# EAGLE design binarywatch (EAGLE 6.6.0)
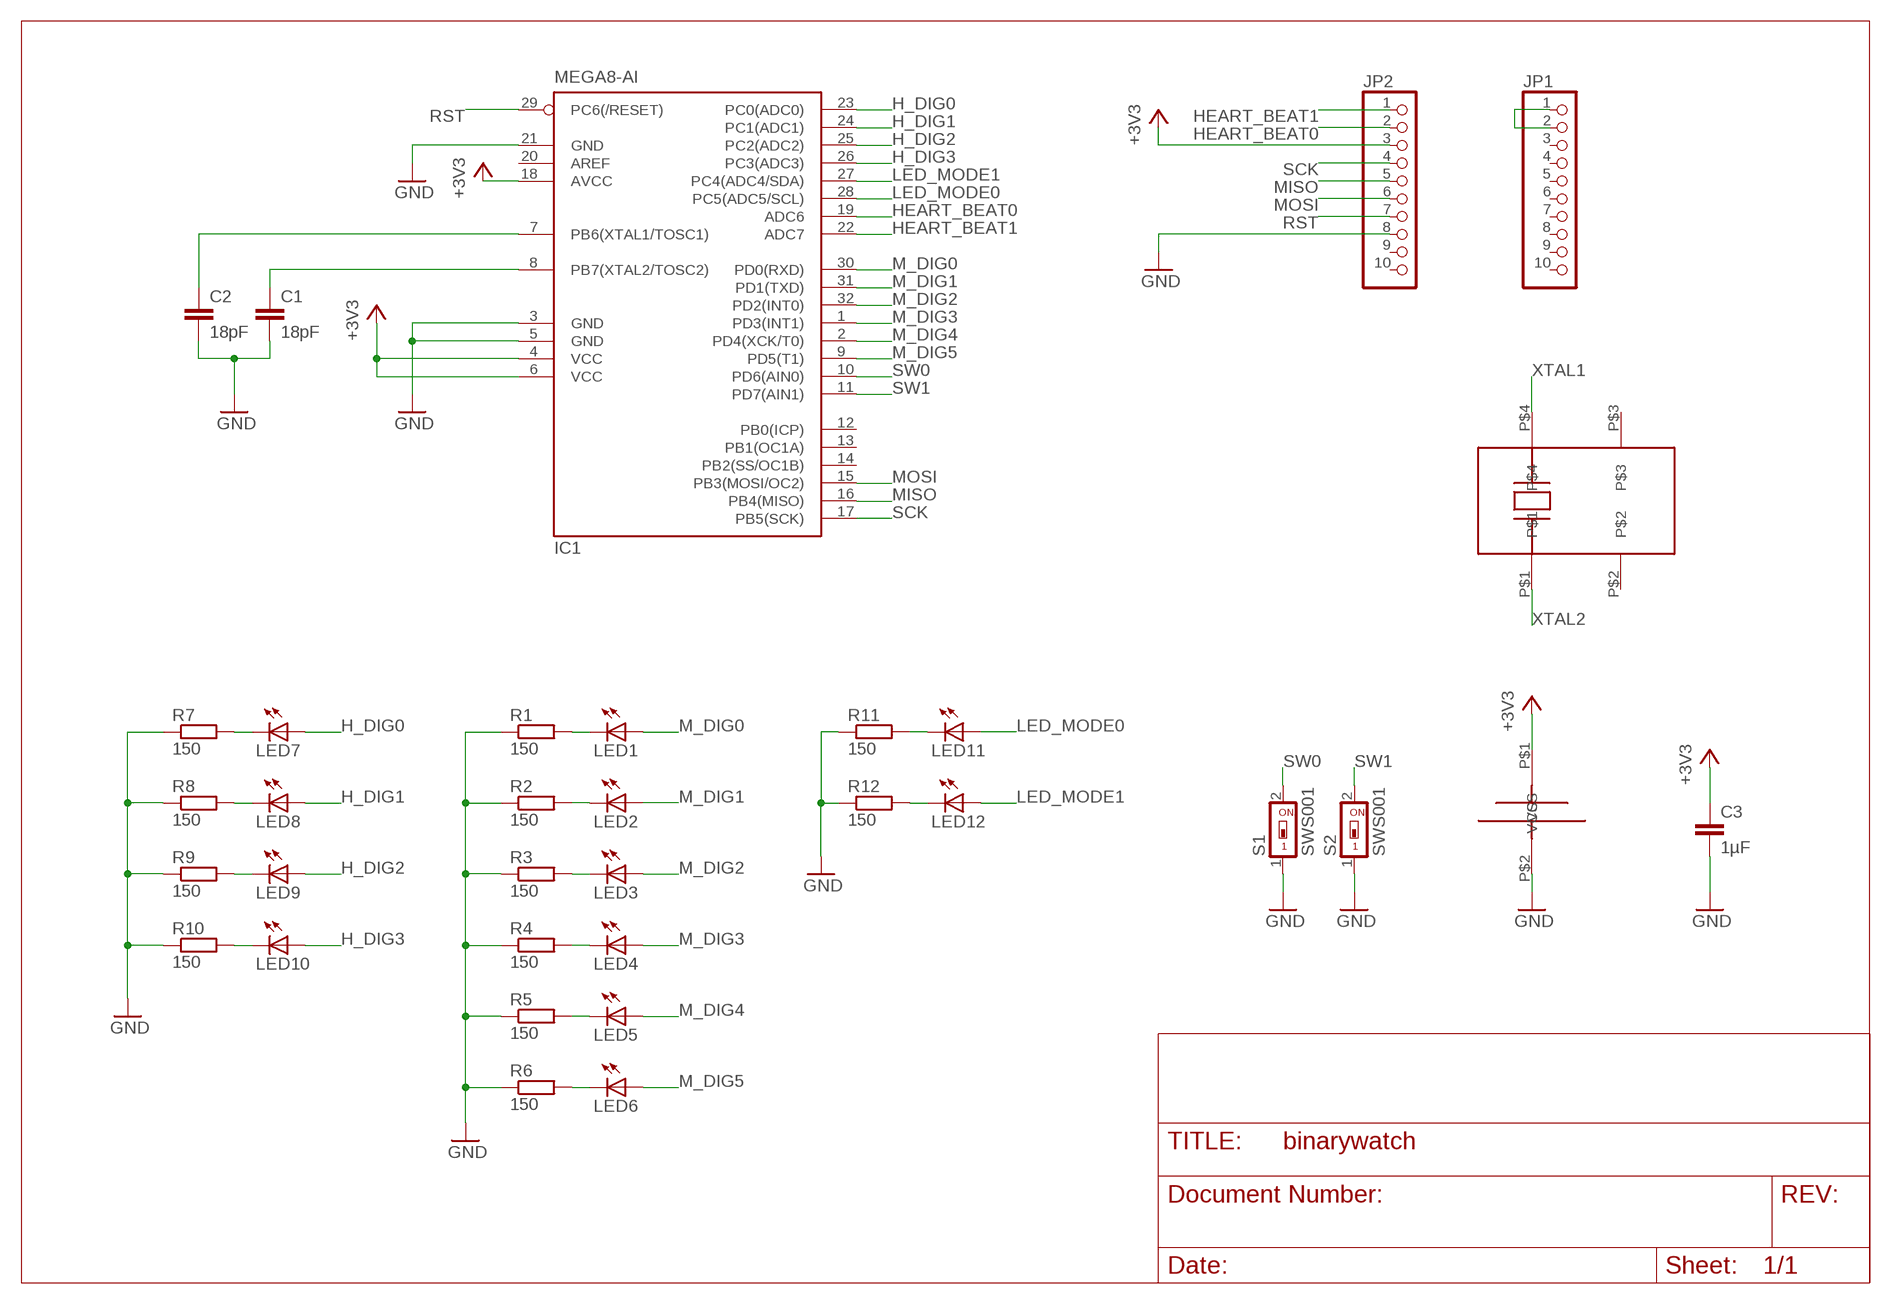
[diagram p0: schematic, sheet 1]

## Parts
C1  18pF  C-EUC0805  [C0805]
C2  18pF  C-EUC0805  [C0805]
C3  1µF  C-EUC0805  [C0805]
IC1  MEGA8-AI  [TQFP32-08]
JP1  PINHD-1X10  [1X10]
JP2  PINHD-1X10  [1X10]
K1  LZH20-1  [LZH20-1]
LED1  LEDCHIPLED_0805  [CHIPLED_0805]
LED2  LEDCHIPLED_0805  [CHIPLED_0805]
LED3  LEDCHIPLED_0805  [CHIPLED_0805]
LED4  LEDCHIPLED_0805  [CHIPLED_0805]
LED5  LEDCHIPLED_0805  [CHIPLED_0805]
LED6  LEDCHIPLED_0805  [CHIPLED_0805]
LED7  LEDCHIPLED_0805  [CHIPLED_0805]
LED8  LEDCHIPLED_0805  [CHIPLED_0805]
LED9  LEDCHIPLED_0805  [CHIPLED_0805]
LED10  LEDCHIPLED_0805  [CHIPLED_0805]
LED11  LEDCHIPLED_0805  [CHIPLED_0805]
LED12  LEDCHIPLED_0805  [CHIPLED_0805]
R1  150  R-EU_R0805  [R0805]
R2  150  R-EU_R0805  [R0805]
R3  150  R-EU_R0805  [R0805]
R4  150  R-EU_R0805  [R0805]
R5  150  R-EU_R0805  [R0805]
R6  150  R-EU_R0805  [R0805]
R7  150  R-EU_R0805  [R0805]
R8  150  R-EU_R0805  [R0805]
R9  150  R-EU_R0805  [R0805]
R10  150  R-EU_R0805  [R0805]
R11  150  R-EU_R0805  [R0805]
R12  150  R-EU_R0805  [R0805]
S1  SWS001  [SMS-001]
S2  SWS001  [SMS-001]
U$1  32768KHZ  [32768KHZ]

## Nets
+3V3: C3.1 IC1.4(VCC) IC1.6(VCC) IC1.18(AVCC) JP2.3 K1.P$1(VCC)
GND: C1.2 C2.2 C3.2 IC1.3(GND) IC1.5(GND) IC1.21(GND) JP2.8 K1.P$2(VSS) R1.1 R2.1 R3.1 R4.1 R5.1 R6.1 R7.1 R8.1 R9.1 R10.1 R11.1 R12.1 S1.1 S2.1
H_DIG0: IC1.23(PC0(ADC0)) LED7.A
H_DIG1: IC1.24(PC1(ADC1)) LED8.A
H_DIG2: IC1.25(PC2(ADC2)) LED9.A
H_DIG3: IC1.26(PC3(ADC3)) LED10.A
HEART_BEAT0: IC1.19(ADC6) JP2.2
HEART_BEAT1: IC1.22(ADC7) JP2.1
LED_MODE0: IC1.28(PC5(ADC5/SCL)) LED11.A
LED_MODE1: IC1.27(PC4(ADC4/SDA)) LED12.A
M_DIG0: IC1.30(PD0(RXD)) LED1.A
M_DIG1: IC1.31(PD1(TXD)) LED2.A
M_DIG2: IC1.32(PD2(INT0)) LED3.A
M_DIG3: IC1.1(PD3(INT1)) LED4.A
M_DIG4: IC1.2(PD4(XCK/T0)) LED5.A
M_DIG5: IC1.9(PD5(T1)) LED6.A
MISO: IC1.16(PB4(MISO)) JP2.5
MOSI: IC1.15(PB3(MOSI/OC2)) JP2.6
N$1: LED7.C R7.2
N$2: LED8.C R8.2
N$3: LED9.C R9.2
N$4: LED10.C R10.2
N$5: LED1.C R1.2
N$6: LED2.C R2.2
N$7: LED3.C R3.2
N$8: LED4.C R4.2
N$11: LED11.C R11.2
N$12: LED12.C R12.2
N$15: LED6.C R6.2
N$16: LED5.C R5.2
N$17: JP1.1 JP1.2
RST: IC1.29(PC6(/RESET)) JP2.7
SCK: IC1.17(PB5(SCK)) JP2.4
SW0: IC1.10(PD6(AIN0)) S1.2
SW1: IC1.11(PD7(AIN1)) S2.2
XTAL1: C2.1 IC1.7(PB6(XTAL1/TOSC1)) U$1.P$4
XTAL2: C1.1 IC1.8(PB7(XTAL2/TOSC2)) U$1.P$1
Unconnected: IC1.12(PB0(ICP)) IC1.13(PB1(OC1A)) IC1.14(PB2(SS/OC1B)) IC1.20(AREF) JP1.3 JP1.4 JP1.5 JP1.6 JP1.7 JP1.8 JP1.9 JP1.10 JP2.9 JP2.10 U$1.P$2 U$1.P$3

## Library data of the parts
C1-C3 = rcl:C-EU: CAPACITOR, European symbol
IC1 = atmel:MEGA8: MICROCONTROLLER 8 Kbytes FLASH, 1 kbytes SRAM, 512 bytes EEPROM, USART, 6-channel 10 bit ADC, 2-channel 8 bit ADC Pin compatible with Atmega48, ATMega88, ATMega168 Source: avr.lbr; MPN: ATMEGA8-16AU; OC_FARNELL: 9171371; OC_NEWARK: 73M8863
JP1 JP2 = pinhead:PINHD-1X10: PIN HEADER
K1 = kzh20-1:LZH20-1
LED1-LED12 = led:LED: LED OSRAM: - CHIPLED LG R971, LG N971, LY N971, LG Q971, LY Q971, LO R971, LY R971 LH N974, LH R974 LS Q976, LO Q976, LY Q976 LO Q996 - Hyper CHIPLED LW Q18S LB Q993, LB Q99A, LB R99A - SideLED LS A670, LO A670, LY A670, LG A670, LP A670 LB A673, LV A673, LT A673, LW A673 LH A674 LY A675 LS A676, LA A676, LO A676, LY A676, LW A676 LS A679, LY A679, LG A679 - Hyper Micro SIDELED® LS Y876, LA Y876, LO Y876, LY Y876 LT Y87S - SmartLED LW L88C, LW L88S LB L89C, LB L89S, LG L890 LS L89K, LO L89K, LY L89K LS L896, LA L896, LO L896, LY L896 - TOPLED LS T670, LO T670, LY T670, LG T670, LP T670 LSG T670, LSP T670, LSY T670, LOP T670, LYG T670 LG T671, LOG T671, LSG T671 LB T673, LV T673, LT T673, LW T673 LH T674 LS T676, LA T676, LO T676, LY T676, LB T676, LH T676, LSB T676, LW T676 LB T67C, LV T67C, LT T67C, LS T67K, LO T67K, LY T67K, LW E67C LS E67B, LA E67B, LO E67B, LY E67B, LB E67C, LV E67C, LT E67C LW T67C LS T679, LY T679, LG T679 LS T770, LO T770, LY T770, LG T770, LP T770 LB T773, LV T773, LT T773, LW T773 LH T774 LS E675, LA E675, LY E675, LS T675 LS T776, LA T776, LO T776, LY T776, LB T776 LHGB T686 LT T68C, LB T68C - Hyper Mini TOPLED® LB M676 - Mini TOPLED Santana® LG M470 LS M47K, LO M47K, LY M47K Source: http://www.osram.convergy.de LUXEON: - LUMILED® LXK2-PW12-R00, LXK2-PW12-S00, LXK2-PW14-U00, LXK2-PW14-V00 LXK2-PM12-R00, LXK2-PM12-S00, LXK2-PM14-U00 LXK2-PE12-Q00, LXK2-PE12-R00, LXK2-PE12-S00, LXK2-PE14-T00, LXK2-PE14-U00 LXK2-PB12-K00, LXK2-PB12-L00, LXK2-PB12-M00, LXK2-PB14-N00, LXK2-PB14-P00, LXK2-PB14-Q00 LXK2-PR12-L00, LXK2-PR12-M00, LXK2-PR14-Q00, LXK2-PR14-R00 LXK2-PD12-Q00, LXK2-PD12-R00, LXK2-PD12-S00 LXK2-PH12-R00, LXK2-PH12-S00 LXK2-PL12-P00, LXK2-PL12-Q00, LXK2-PL12-R00 Source: www.luxeon.com KINGBRIGHT: KA-3528ASYC Source: www.kingbright.com
R1-R12 = rcl:R-EU_: RESISTOR, European symbol
S1 S2 = smd-special:SWS001: SMD Dip Switch 1 pol.
U$1 = kzh20-1:32768KHZ

## Board
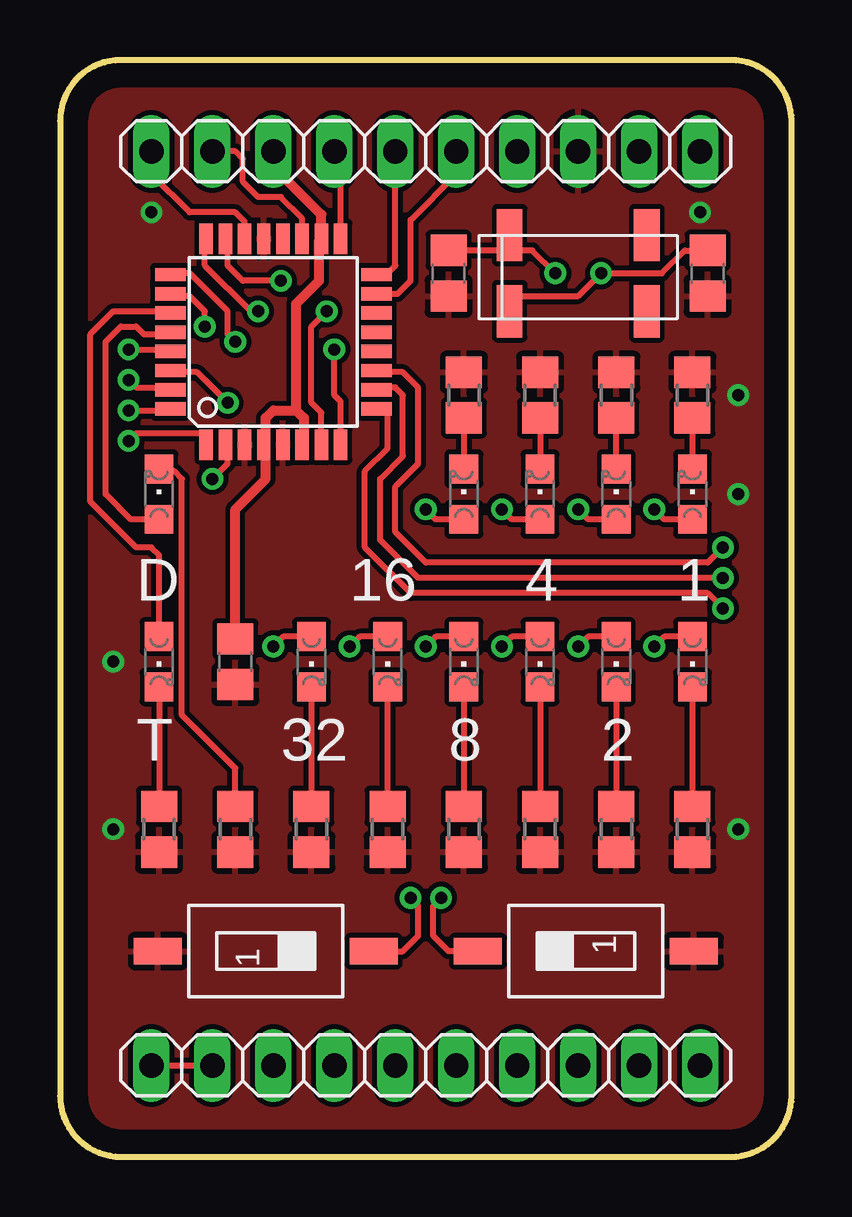
[diagram p1: board, top side]
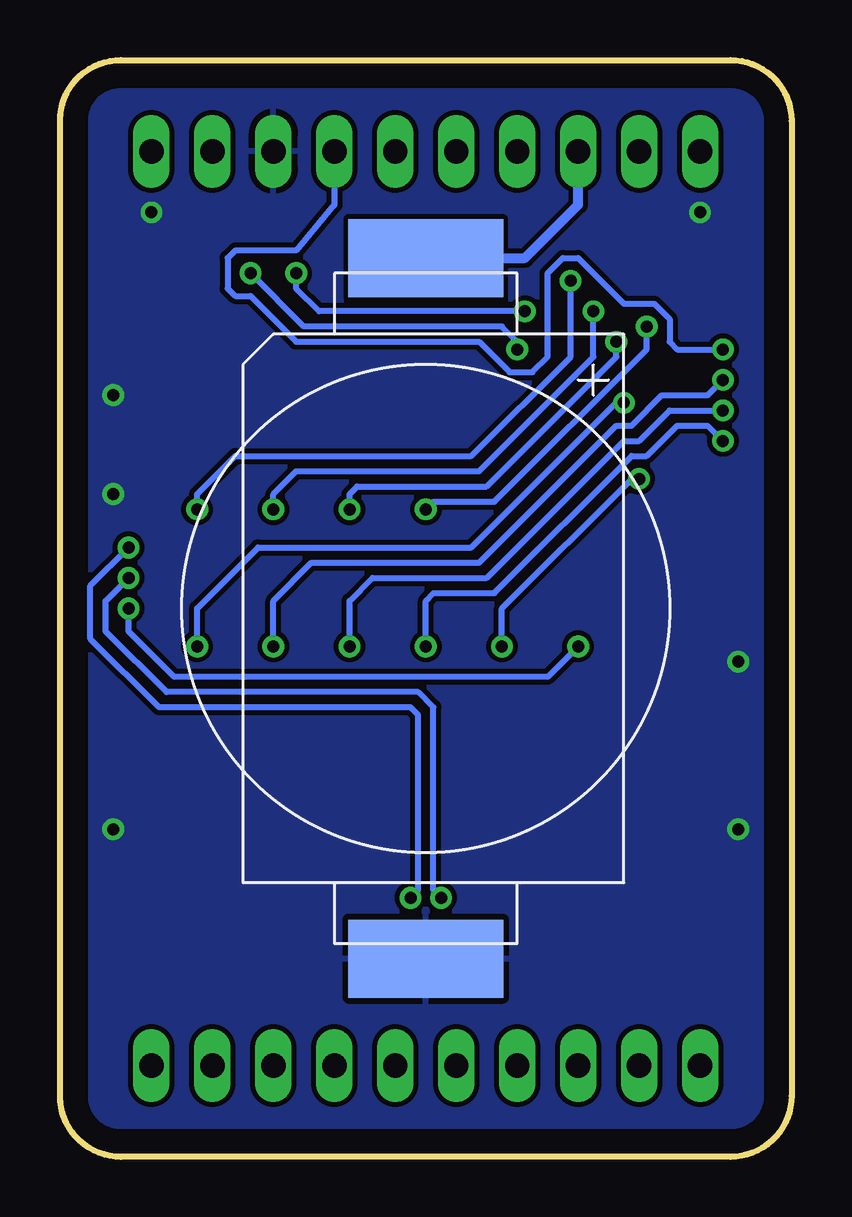
[diagram p2: board, bottom side, seen from below]

Size 30.48 x 45.72 mm. Coordinates in mm from the lower left corner, seen from the top.
Outline: 30.48,2.54 30.48,43.18 arc90 27.94,45.72 2.54,45.72 arc90 0,43.18 0,2.54 arc90 2.54,0 27.94,0 arc90 30.48,2.54
Copper layers (1*16): Top 0.035mm / dielectric 1.5mm / Bottom 0.035mm
Design rules "default *": minimum track width 10mil, minimum drill 16mil, track to track 8mil, track to pad 8mil, pad to pad 8mil, via to via 8mil, smd to smd 8mil, copper to edge 40mil, drill to drill 8mil, minimum pad ring 10mil, minimum via ring 8mil, stop-mask expansion 4mil, vias tented up to drill 0mil, thermal gap 10mil

### Footprints (pad centres in the part's own frame; a part is rotated, then mirrored left to right if it is on the bottom)
C0805 = smd 1.3 x 1.5: 1 -0.95,0; 2 0.95,0
TQFP32-08 = smd 1.27 x 0.559: 1 -4.293,2.8; 2 -4.293,2; 3 -4.293,1.2; 4 -4.293,0.4; 5 -4.293,-0.4; 6 -4.293,-1.2; 7 -4.293,-2; 8 -4.293,-2.8; 17 4.293,-2.8; 18 4.293,-2; 19 4.293,-1.2; 20 4.293,-0.4; 21 4.293,0.4; 22 4.293,1.2; 23 4.293,2; 24 4.293,2.8 | smd 0.559 x 1.27: 9 -2.8,-4.293; 10 -2,-4.293; 11 -1.2,-4.293; 12 -0.4,-4.293; 13 0.4,-4.293; 14 1.2,-4.293; 15 2,-4.293; 16 2.8,-4.293; 25 2.8,4.293; 26 2,4.293; 27 1.2,4.293; 28 0.4,4.293; 29 -0.4,4.293; 30 -1.2,4.293; 31 -2,4.293; 32 -2.8,4.293
1X10 = drill 1.016 long: 1 -11.43,0; 2 -8.89,0; 3 -6.35,0; 4 -3.81,0; 5 -1.27,0; 6 1.27,0; 7 3.81,0; 8 6.35,0; 9 8.89,0; 10 11.43,0
LZH20-1 = smd 3.251 x 6.452: P$1 14.605,0; P$2 -14.605,0
CHIPLED_0805 = smd 1.2 x 1.2: A 0,-1.05; C 0,1.05
R0805 = smd 1.3 x 1.5: 1 -0.95,0; 2 0.95,0
SMS-001 = smd 1.092 x 2.007: 1 0,-4.496; 2 0,4.496
32768KHZ = smd 1.067 x 2.184: P$1 -2.857,-1.587; P$2 2.857,-1.587; P$3 2.857,1.587; P$4 -2.857,1.587

### Placement (x,y rotation side)
C1  26.99,36.83 270 top
C2  16.19,36.83 270 top
C3  7.3,20.64 270 top
IC1  8.89,33.97 90 top
JP1  15.24,3.81 0 top
JP2  15.24,41.91 0 top
K1  15.24,22.86 90 bottom
LED1  26.35,20.64 180 top
LED2  23.18,20.64 180 top
LED3  20,20.64 180 top
LED4  16.83,20.64 180 top
LED5  13.65,20.64 180 top
LED6  10.48,20.64 180 top
LED7  26.35,27.62 0 top
LED8  23.18,27.62 0 top
LED9  20,27.62 0 top
LED10  16.83,27.62 0 top
LED11  4.13,27.62 0 top
LED12  4.13,20.64 180 top
R1  26.35,13.65 90 top
R2  23.18,13.65 90 top
R3  20,13.65 90 top
R4  16.83,13.65 90 top
R5  13.65,13.65 90 top
R6  10.48,13.65 90 top
R7  26.35,31.75 270 top
R8  23.18,31.75 270 top
R9  20,31.75 270 top
R10  16.83,31.75 270 top
R11  7.3,13.65 90 top
R12  4.13,13.65 90 top
S1  8.57,8.57 270 top
S2  21.91,8.57 90 top
U$1  21.59,36.83 0 top

### Tracks (layer width: path | path; a pad name or v marks a point on that pad's centre or on a via)
+3V3
  Top 0.406: C3.1 7.3,26.99 8.57,28.26 8.57,29.6 | 8.57,29.6 IC1.4 | 8.57,29.6 8.57,30.8 8.89,31.11 9.84,31.11 | 9.84,31.11 10.16,30.8 10.16,29.75 IC1.6 | 9.84,31.11 9.84,35.56 10.79,36.51 10.79,38.17 IC1.18 10.89,39.27 8.89,41.27 JP2.3
  Bottom 0.406: K1.P$1 11.11,37.47 8.89,39.69 JP2.3
GND  (via drill 0.5)
  Top 0.254: 7.7,29.84 7.62,29.84 IC1.3 7.62,29.53 7.68,29.53 | 8.5,38.42 8.57,38.42 IC1.21 8.57,38.1 8.48,38.1
  other vias: 3.81,39.37 26.67,39.37 28.26,31.75 28.26,27.62 28.26,13.65 2.22,13.65 2.22,20.64
  pour Top: 1.27,44.45 29.21,44.45 29.21,0.95 1.27,0.95
  pour Bottom: 1.27,44.45 29.21,44.45 29.21,0.95 1.27,0.95
H_DIG0  (via drill 0.5)
  Top 0.254: LED7.A 25.18,26.57 v24.77,26.99 | v9.21,36.51 7.62,36.51 6.99,37.15 6.99,38.17 IC1.23
  Bottom 0.254: v24.77,26.99 24.77,27.62 23.18,29.21 13.34,29.21 9.21,33.34 v9.21,36.51
H_DIG1  (via drill 0.5)
  Top 0.254: LED8.A 22,26.57 v21.59,26.99 | v8.26,35.24 7.94,35.24 6.03,37.15 6.03,38.21 IC1.24
  Bottom 0.254: v21.59,26.99 21.59,27.62 20.64,28.57 13.02,28.57 8.26,33.34 v8.26,35.24
H_DIG2  (via drill 0.5)
  Top 0.254: LED9.A 18.83,26.57 v18.41,26.99 | v7.3,33.97 6.99,34.29 6.99,35.24 5.4,36.83 4.66,36.83 IC1.25
  Bottom 0.254: v18.41,26.99 18.41,27.62 18.1,27.94 12.7,27.94 7.3,33.34 v7.3,33.97
H_DIG3  (via drill 0.5)
  Top 0.254: LED10.A 15.65,26.57 v15.24,26.99 | v6.03,34.61 6.03,35.24 5.4,35.88 4.69,35.88 IC1.26
  Bottom 0.254: v15.24,26.99 14.92,27.3 12.38,27.3 6.03,33.66 v6.03,34.61
HEART_BEAT0
  Top 0.254: IC1.19 10.09,39.12 9.21,40.01 8.26,40.01 7.62,40.64 7.62,41.59 7.3,41.91 JP2.2
HEART_BEAT1
  Top 0.254: IC1.22 7.69,38.98 7.3,39.37 5.4,39.37 3.81,40.96 JP2.1
LED_MODE0
  Top 0.254: LED11.A 2.96,26.57 1.91,27.62 1.91,33.97 2.54,34.61 3.17,34.61 3.49,34.29 4.51,34.29 IC1.28
LED_MODE1
  Top 0.254: LED12.A 4.13,25.08 3.81,25.4 3.17,25.4 1.27,27.3 1.27,34.29 2.22,35.24 4.53,35.24 IC1.27
M_DIG0  (via drill 0.5)
  Top 0.254: LED1.A 25.18,21.69 v24.77,21.27 | v6.99,31.43 5.71,32.7 4.67,32.7 IC1.30
  Bottom 0.254: v24.77,21.27 24.77,22.86 22.23,25.4 13.34,25.4 7.3,31.43 v6.99,31.43
M_DIG1  (via drill 0.5)
  Top 0.254: LED2.A 22,21.69 v21.59,21.27 | v2.86,32.38 3.17,32.07 4.5,32.07 IC1.31
  Bottom 0.254: v21.59,21.27 21.59,23.18 20,24.77 13.02,24.77 7.3,30.48 6.67,30.48 5.4,31.75 3.49,31.75 v2.86,32.38
M_DIG2  (via drill 0.5)
  Top 0.254: LED3.A 18.83,21.69 v18.41,21.27 | v2.86,31.11 4.54,31.11 IC1.32
  Bottom 0.254: v18.41,21.27 18.41,23.18 17.46,24.13 12.7,24.13 6.99,29.84 6.35,29.84 5.08,31.11 v2.86,31.11
M_DIG3  (via drill 0.5)
  Top 0.254: LED4.A 15.65,21.69 v15.24,21.27 | v2.86,29.84 3.17,30.16 6.03,30.16 6.03,29.84 6.24,29.84 IC1.1
  Bottom 0.254: v15.24,21.27 15.24,23.18 14.92,23.5 12.38,23.5 6.67,29.21 6.03,29.21 4.76,30.48 3.49,30.48 v2.86,29.84
M_DIG4  (via drill 0.5)
  Top 0.254: LED5.A 12.48,21.69 v12.06,21.27 | v6.35,28.26 6.99,28.89 6.99,29.9 IC1.2
  Bottom 0.254: v12.06,21.27 12.06,22.86 6.67,28.26 v6.35,28.26
M_DIG5  (via drill 0.5)
  Top 0.254: LED6.A 9.3,21.69 v8.89,21.27 | v27.62,22.86 26.99,23.5 14.61,23.5 12.7,25.4 12.7,28.57 13.65,29.53 13.65,31.11 12.7,31.02 IC1.9
  Bottom 0.254: v8.89,21.27 10.16,20 25.72,20 27.62,21.91 v27.62,22.86
MISO
  Top 0.254: IC1.16 13.6,36.77 13.97,37.15 JP2.5
MOSI
  Top 0.254: IC1.15 14.06,35.97 14.61,36.51 14.61,39.05 16.51,40.96 JP2.6
N$1
  Top 0.254: R7.2 LED7.C
N$2
  Top 0.254: LED8.C R8.2
N$3
  Top 0.254: R9.2 LED9.C
N$4
  Top 0.254: R10.2 LED10.C
N$5
  Top 0.254: LED1.C R1.2
N$6
  Top 0.254: LED2.C R2.2
N$7
  Top 0.254: LED3.C R3.2
N$8
  Top 0.254: LED4.C R4.2
N$11
  Top 0.254: R11.2 7.3,16.19 5.08,18.41 5.08,28.26 4.76,28.57 4.22,28.57 LED11.C
N$12
  Top 0.254: LED12.C R12.2
N$15
  Top 0.254: LED6.C R6.2
N$16
  Top 0.254: R5.2 LED5.C
N$17
  Top 0.254: JP1.1 JP1.2
RST  (via drill 0.5)
  Top 0.254: v2.86,33.66 4.51,33.66 IC1.29
  Bottom 0.254: JP2.7 19.05,39.69 20.64,37.78 23.18,37.78 23.5,37.47 23.5,36.2 23.18,35.88 22.54,35.88 20.64,33.97 13.02,33.97 11.75,32.7 10.79,32.7 10.16,33.34 10.16,36.83 9.53,37.47 8.89,37.47 6.99,35.56 5.71,35.56 5.08,34.92 5.08,33.97 4.76,33.66 v2.86,33.66
SCK
  Top 0.254: IC1.17 11.69,41.65 JP2.4
SW0  (via drill 0.5)
  Top 0.254: S1.2 14.29,8.57 14.92,9.21 14.92,10.48 v14.61,10.79 | v27.62,24.13 14.92,24.13 13.34,25.72 13.34,28.26 14.29,29.21 14.29,31.75 13.97,32.07 13.28,32.07 IC1.10
  Bottom 0.254: v14.61,10.79 14.92,11.11 14.92,18.73 15.56,19.37 26.04,19.37 28.57,21.91 28.57,23.18 v27.62,24.13
SW1  (via drill 0.5)
  Top 0.254: S2.2 16.19,8.57 15.56,9.21 15.56,10.48 v15.88,10.79 | v27.62,25.4 26.99,24.77 15.24,24.77 13.97,26.04 13.97,27.94 14.92,28.89 14.92,32.07 14.29,32.7 13.25,32.7 IC1.11
  Bottom 0.254: v15.88,10.79 15.56,11.11 15.56,18.41 15.88,18.73 26.35,18.73 29.21,21.59 29.21,23.81 v27.62,25.4
XTAL1  (via drill 0.5)
  Top 0.254: IC1.7 10.89,31.02 10.48,31.43 10.48,34.61 v11.11,35.24 | v20.64,36.83 19.68,37.78 19.05,37.78 18.73,38.1 U$1.P$4 18.41,37.78 16.51,37.78 16.19,38.1 16.2,37.47 C2.1
  Bottom 0.254: v11.11,35.24 19.68,35.24 20.64,36.2 v20.64,36.83
XTAL2  (via drill 0.5)
  Top 0.254: IC1.8 11.69,31.49 11.43,31.75 v11.43,33.66 | C1.1 26.04,37.78 25.08,36.83 v22.54,36.83 21.59,35.88 18.73,35.88 U$1.P$1
  Bottom 0.254: v11.43,33.66 11.43,33.97 12.06,34.61 20.32,34.61 v22.54,36.83

### Text on the board
tPlace: D | 16 | 4 | 1 | T | 32 | 8 | 2